# Altium schematic sheet DASH_CAN.SchDoc
size A
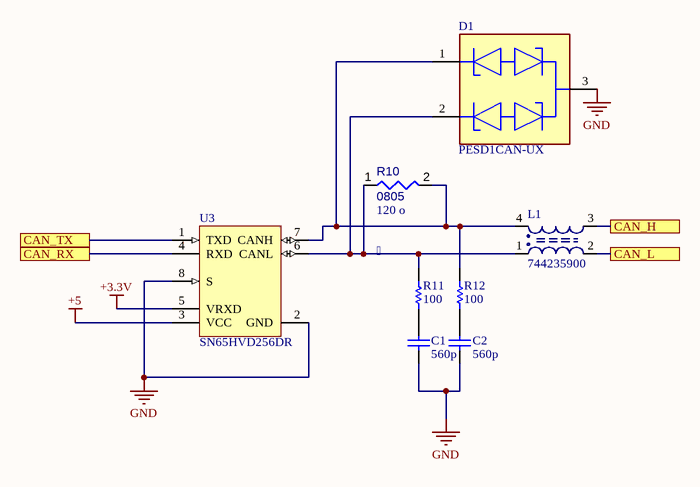
[diagram p0: DASH_CAN.SchDoc]

## Parts
C1  560p  [CAPC1608X87X35NL15T15]
C2  560p  [CAPC1608X87X35NL15T15]
D1  PESD1CAN-UX  [FP-SOT323-MFG]
L1  744235900  [WE-CNSW 1812]
R10  0805  value 120 o  Max Operating Temperature:   [RESC0805(2012)_L]
R11  100  [RESC1608X55X25ML10T15]
R12  100  [RESC1608X55X25ML10T15]
U3  SN65HVD256DR  [D0008A_L]

## Ports
CAN_H, CAN_L, CAN_RX, CAN_TX

## Nets
+3.3V: U3.5(VRXD)
+5: U3.3(VCC)
GND: C1.1 C2.1 D1.3(common_cathode) U3.2(GND) U3.8(S)
CAN_H: L1.3 ; port CAN_H
CAN_L: L1.2 ; port CAN_L
CAN_RX: U3.4(RXD) ; port CAN_RX
CAN_TX: U3.1(TXD) ; port CAN_TX
NetC1_2: C1.2 R11.1
NetC2_2: C2.2 R12.1
NetD1_1: D1.1(cathode_1) L1.4 R10.2 R12.2 U3.7(CANH)
NetD1_2: D1.2(cathode_2) L1.1 R10.1 R11.2 U3.6(CANL)

## Library data of the parts
C1 C2 = CMP-2006-03887-1: .1 uf; Part Number: C0603C104J3RAC7867; Manufacturer: Kemet
D1 = CMP-14436-000006-1: TVS DIODE 24V 50V SC70-3
L1 = CMP-1372-00007-1: SMD Shielded Coupled Inductor WE-CNSW, Z=90 Ohm; Manufacturer: Wuerth Elektronik; Impedance: 90 Ohm; PartNumber: 744235900; ComponentLink1URL: http://www.we-online.com; ComponentLink1Description: Manufacturer URL; ComponentLink2Description: Datasheet; PackageReference: WE-CNSW 1812; ComponentLink2URL: http://katalog.we-online.de/pbs/datasheet/744235900.pdf
R10 = CMP-009-000170-1: Chip Resistor, 4,7 Ohms, +/-5 %, 125 mW, -55 to 155 degC, 0805; Available Preview Images: 2D; Design Item ID: CMP-009-00174-2; Source: Integrated_Library - 12.03.21 - 15.39.SchLib
R11 R12 = CMP-009-000010-1: Chip Resistor, 0 Ohm, 0.1 W, -55 to 155 degC, 0603 (1608 Metric); Source: Integrated_Library - 12.03.21 - 15.39.SchLib; Design Item ID: CMP-009-00006-4
U3 = CMP-0315-00070-2: CAN Transceiver with Fast Loop Times for Highly Loaded Networks, 85 mA, 5 V, -40 to 125 degC, 8-pin SOIC (D), Green (RoHS & no Sb/Br); Manufacturer: Texas Instruments; ICC(Max)(mA): 85; Supply Voltage(s)(V): 5; Drivers Per Package: 1; Rating: Catalog; Bus Fault Voltage(V): -27 to 40; Features: Short prop delay, Fast loop times, RXD supply input; PackageReference: D0008A; ComponentLink1Description: Datasheet; Code_JEDEC: MS-012AA; PackageDescription: 8-Pin Plastic Small Outline Integrated Circuit, 4.9 x 3.9 mm, Pitch 1.27 mm Pitch; PackageVersion: revM, Jun-2011; PartNumber: SN65HVD256DR; Isolated: No; Eco-Plan: Green (RoHS & no Sb/Br); ComponentLink1URL: http://www.ti.com/general/docs/lit/getliterature.tsp?genericPartNumber=SN65HVD256&fileType=pdf; Footprint: TJA1051T/3; Mounting Technology: Surface Mount; Receivers Per Package: 1; SubFamily: CAN; DatasheetVersion: SLLSEA2